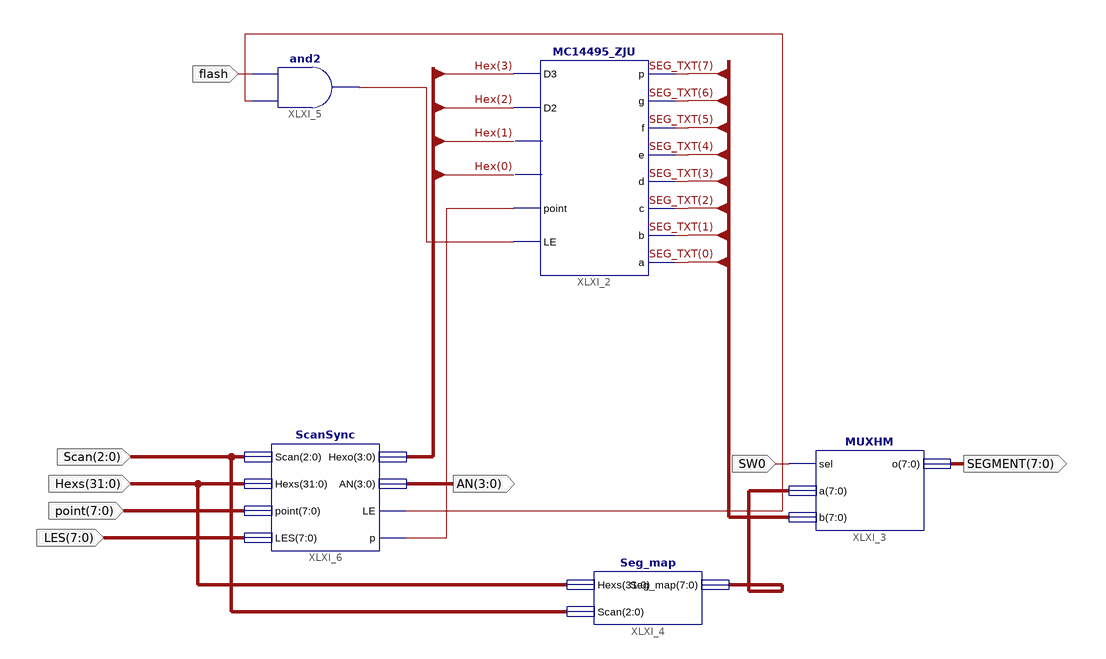
[diagram p0: schematic sheet 1]
// Xilinx ISE schematic Seg7_Dev.sch (kintex7) as structural Verilog: 5 symbols, 8 ports
module Seg7_Dev (
  input  SW0,
  input  [2:0] Scan,
  input  [31:0] Hexs,
  input  flash,
  input  [7:0] LES,
  input  [7:0] point,
  output [7:0] SEGMENT,
  output [3:0] AN
);

  wire XLXN_37, XLXN_51, XLXN_52;
  wire [3:0] Hex;
  wire [7:0] SEG_TXT, XLXN_2;

  MUXHM XLXI_3 (.sel(SW0), .a(XLXN_2), .b(SEG_TXT), .o(SEGMENT));
  MC14495_ZJU XLXI_2 (
    .p(SEG_TXT[7]), .g(SEG_TXT[6]), .f(SEG_TXT[5]), .e(SEG_TXT[4]), .d(SEG_TXT[3]), .c(SEG_TXT[2]),
    .b(SEG_TXT[1]), .a(SEG_TXT[0]), .D0(Hex[0]), .D1(Hex[1]), .D2(Hex[2]), .D3(Hex[3]), .LE(XLXN_37),
    .point(XLXN_51));
  and XLXI_5 (XLXN_37, XLXN_52, flash);
  Seg_map XLXI_4 (.Hexs(Hexs), .Scan(Scan), .Seg_map(XLXN_2));
  ScanSync XLXI_6 (.Scan(Scan), .Hexs(Hexs), .point(point), .LES(LES), .Hexo(Hex), .AN(AN), .LE(XLXN_52), .p(XLXN_51));
endmodule
